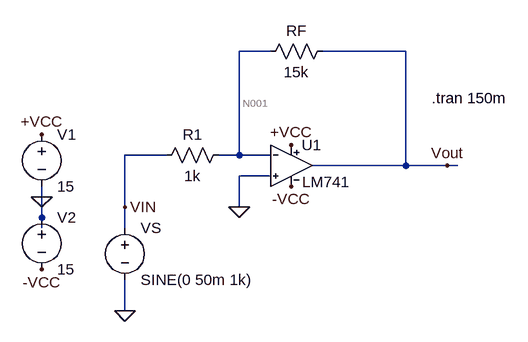
[diagram p0: schematic Draft2.asc]
Draft2.asc, the LTspice schematic file:
Version 4
SHEET 1 880 680
WIRE 208 -64 160 -64
WIRE 416 -64 288 -64
WIRE 48 96 -16 96
WIRE 160 96 160 -64
WIRE 160 96 128 96
WIRE 208 96 160 96
WIRE 416 112 416 -64
WIRE 416 112 272 112
WIRE 480 112 416 112
WIRE 496 112 480 112
WIRE 208 128 160 128
WIRE -144 160 -144 144
WIRE -16 176 -16 96
WIRE 160 176 160 128
WIRE -144 192 -144 160
WIRE -144 208 -144 192
WIRE -16 208 -16 176
WIRE -16 336 -16 288
FLAG -144 64 +VCC
FLAG 240 80 +VCC
FLAG 160 176 0
FLAG 480 112 Vout
FLAG -16 336 0
FLAG -144 272 -VCC
FLAG 240 144 -VCC
FLAG -144 160 0
FLAG -16 176 VIN
SYMBOL LM741 240 48 R0
SYMATTR InstName U1
SYMBOL voltage -144 48 R0
WINDOW 123 0 0 Left 0
WINDOW 39 0 0 Left 0
SYMATTR InstName V1
SYMATTR Value 15
SYMBOL voltage -144 176 R0
WINDOW 123 0 0 Left 0
WINDOW 39 0 0 Left 0
SYMATTR InstName V2
SYMATTR Value 15
SYMBOL voltage -16 192 R0
WINDOW 123 0 0 Left 0
WINDOW 39 0 0 Left 0
SYMATTR InstName VS
SYMATTR Value SINE(0 50m 1k)
SYMBOL res 144 80 R90
WINDOW 0 0 56 VBottom 2
WINDOW 3 32 56 VTop 2
SYMATTR InstName R1
SYMATTR Value 1k
SYMBOL res 304 -80 R90
WINDOW 0 0 56 VBottom 2
WINDOW 3 32 56 VTop 2
SYMATTR InstName RF
SYMATTR Value 15k
TEXT 456 8 Left 2 !.tran 150m

The netlist it stands for:
* Draft2.asc
XU1 0 N001 +VCC -VCC Vout LM741  ; pins In+ In- V+ V- OUT
V1 +VCC 0 15
V2 0 -VCC 15
VS VIN 0 SINE(0 50m 1k)
R1 N001 VIN 1k
RF Vout N001 15k
.tran 150m
.lib LM741.lib
.backanno
.end

* Results of the author's LTspice run, read from the files saved beside the schematic
* Operating Point, zero values left out:
*   V(n001) = 999.9 µV
*   V(-vcc) = -15 V
*   V(+vcc) = 15 V
*   V(vout) = 17.53 mV
*   I(Rf) = 1.102 µA
*   I(R1) = 999.9 nA
*   I(Vs) = 999.9 nA
*   I(V2) = -1.701 mA
*   I(V1) = -1.702 mA
*   Ix(u1:1) = 57.86 nA
*   Ix(u1:2) = 101.9 nA
*   Ix(u1:99) = 1.702 mA
*   Ix(u1:50) = -1.701 mA
*   Ix(u1:28) = -1.102 µA
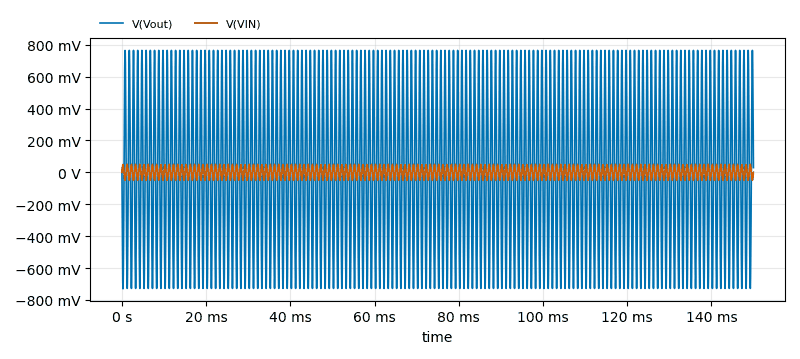
[diagram p1: Transient Analysis of Draft2.asc, plotted from the saved traces]
* Transient Analysis, 1 run:
*   V(Vout): min -730.3 mV, max 765.2 mV, average 17.29 mV, rms 524 mV, last 29.69 mV
*   V(VIN): min -49.87 mV, max 49.88 mV, average 15.71 µV, rms 34.92 mV, last 0 V